# EAGLE design Schematic_start_module_sumo_IR_V0_16 (EAGLE 5.11)
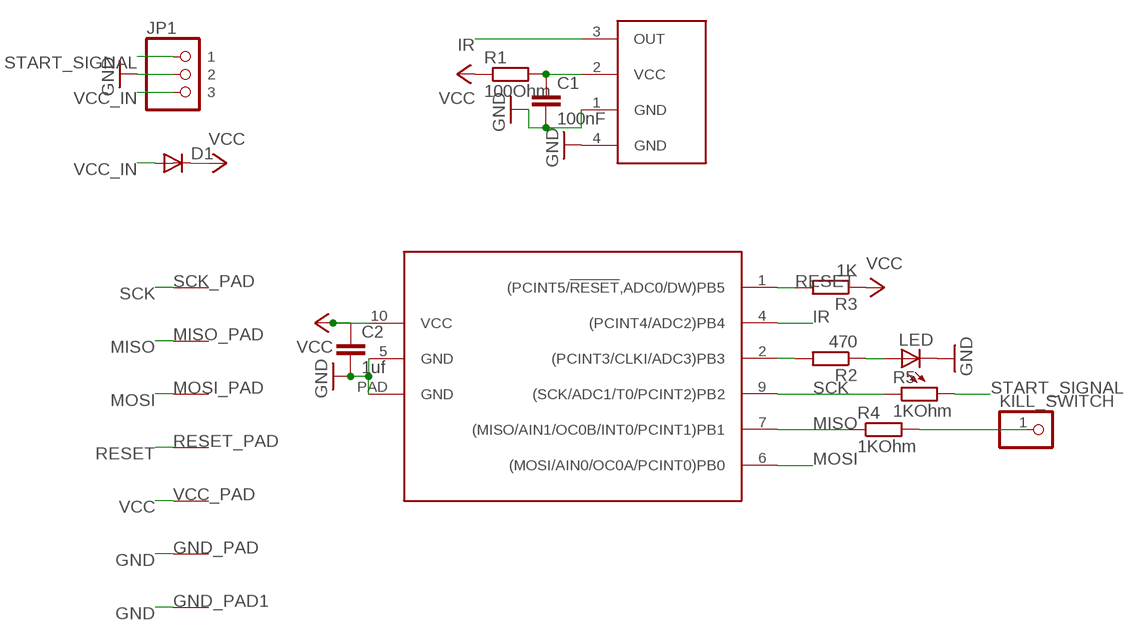
[diagram p0: schematic, sheet 1]

## Parts
C1  100nF  C-EUC0603  [C0603]
C2  1uf  C-EUC0603  [C0603]
D1  DIODE-SOD523  [SOD523]
GND_PAD  PAD50X50  [PAD_50X50]
GND_PAD1  PAD75X75  [PAD_75X75]
IR1  TSOP77338TS  [TSOP77338]
JP1  PINHD-1X3PIN  [1X3]
KILL_SWITCH  PINHD-1X1  [1X01]
LED  LED0603  [0603_SMALL]
MISO_PAD  PAD50X50  [PAD_50X50]
MOSI_PAD  mosi  PAD75X75  [PAD_75X75]
R1  100Ohm  R-EU_R0603  [R0603]
R2  470  R-EU_R0603  [R0603]
R3  1K  R-EU_R0603  [R0603]
R4  1KOhm  R-EU_R0603  [R0603]
R5  1KOhm  R-EU_R0603  [R0603]
RESET_PAD  PAD50X50  [PAD_50X50]
SCK_PAD  PAD50X50  [PAD_50X50]
UC  ATTINY13A  [DFN10]
VCC_PAD  PAD50X50  [PAD_50X50]

## Nets
GND: C1.2 C2.2 GND_PAD1.P$1(PAD) GND_PAD.P$1(PAD) IR1.1(GND) IR1.4(GND) JP1.2 LED.2(C) UC.5(GND) UC.PAD(GND)
IR: IR1.3(OUT) UC.4((PCINT4/ADC2)PB4)
KILL_SWITCH: KILL_SWITCH.1 R4.2
MISO: MISO_PAD.P$1(PAD) R4.1 UC.7((MISO/AIN1/OC0B/INT0/PCINT1)PB1)
MOSI: MOSI_PAD.P$1(PAD) UC.6((MOSI/AIN0/OC0A/PCINT0)PB0)
N$1: R2.2 UC.2((PCINT3/CLKI/ADC3)PB3)
N$3: LED.1(A) R2.1
N$6: C1.1 IR1.2(VCC) R1.2
RESET: R3.2 RESET_PAD.P$1(PAD) UC.1((PCINT5/!RESET,ADC0/DW)PB5)
SCK: R5.1 SCK_PAD.P$1(PAD) UC.9((SCK/ADC1/T0/PCINT2)PB2)
START_SIGNAL: JP1.1 R5.2
VCC: C2.1 D1.C R1.1 R3.1 UC.10(VCC) VCC_PAD.P$1(PAD)
VCC_IN: D1.A JP1.3

## Library data of the parts
C1 C2 = rcl:C-EU: CAPACITOR, European symbol
D1 = diode:DIODE-: DIODE
GND_PAD GND_PAD1 MISO_PAD MOSI_PAD RESET_PAD SCK_PAD VCC_PAD = CRF:PAD
IR1 = CRF:TSOP77338: Liten IR receiver ytmonterad ca 12kr på Farnell. http://www.vishay.com/docs/83346/tsop773.pdf
JP1 = CRF:PINHD-1X3: PIN HEADER
KILL_SWITCH = pinhead:PINHD-1X1: PIN HEADER
LED = CRF:LED: LED
R1-R5 = rcl:R-EU_: RESISTOR, European symbol
UC = CRF:ATTINY13A

## Board
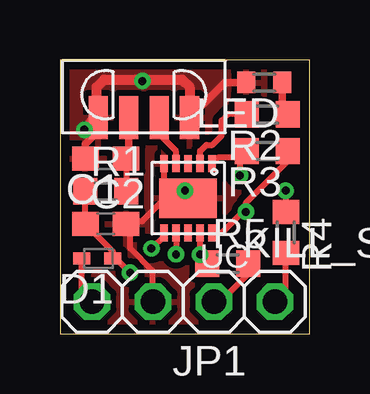
[diagram p1: board, top side]
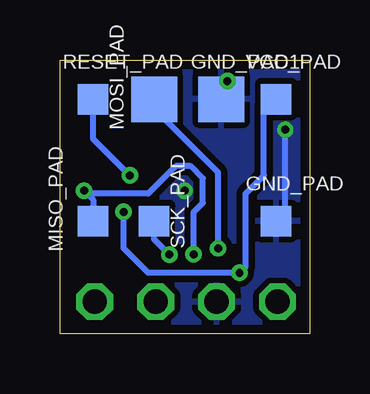
[diagram p2: board, bottom side, seen from below]

Size 10.4 x 11.42 mm. Coordinates in mm from the lower left corner, seen from the top.
Outline: 0,0 10.4,0 10.4,11.42 0,11.42 0,0
Copper layers (1*16): Top 0.0356mm / dielectric 1.5011mm / Bottom 0.0356mm
Design rules "LaenPCBOrder *": minimum track width 6mil, minimum drill 13mil, track to track 8mil, track to pad 8mil, pad to pad 8mil, via to via 8mil, smd to smd 0mil, copper to edge 15mil, drill to drill 6mil, minimum pad ring 7mil, minimum via ring 7mil, stop-mask expansion 4mil, vias tented up to drill 13mil, thermal gap 10mil

### Footprints (pad centres in the part's own frame; a part is rotated, then mirrored left to right if it is on the bottom)
C0603 = smd 1.1 x 1: 1 -0.85,0; 2 0.85,0
SOD523 = smd 0.7 x 0.5: A 0.7,0; C -0.6,0
PAD_50X50 = smd 1.27 x 1.27: P$1 0,0
PAD_75X75 = smd 1.905 x 1.905: P$1 0,0
TSOP77338 = smd 0.8 x 1.8: 1 -1.905,0.635; 2 -0.633,0.635; 3 0.637,0.635; 4 1.905,0.635
1X3 = drill 1.016 octagon: 1 -2.54,0; 2 0,0; 3 2.54,0
1X01 = drill 1.016 octagon: 1 0,0
0603_SMALL = smd 0.75 x 0.9: 1 -0.75,0; 2 0.75,0
R0603 = smd 1 x 1.1: 1 -0.85,0; 2 0.85,0
DFN10 = smd 0.3 x 0.7: 1 -1,-1.45; 2 -0.5,-1.45; 3 0,-1.45; 4 0.5,-1.45; 5 1,-1.45; 6 1,1.45; 7 0.5,1.45; 8 0,1.45; 9 -0.5,1.45; 10 -1,1.45 | smd 2.38 x 1.65: PAD 0,0

### Placement (x,y rotation side)
C1  1.91,7.3 180 top
C2  1.91,4.57 0 top
D1  1.6,3.14 180 top
GND_PAD  1.4,4.7 0 bottom
GND_PAD1  3.68,9.78 0 bottom
IR1  3.49,8.38 0 top
JP1  3.87,1.33 180 top
KILL_SWITCH  8.95,1.33 0 top
LED  8.51,10.48 180 top
MISO_PAD  9.02,4.7 90 bottom
MOSI_PAD  6.48,9.78 90 bottom
R1  1.91,5.94 0 top
R2  8.64,9.14 180 top
R3  8.64,7.62 180 top
R4  9.41,4.22 270 top
R5  6.99,2.92 0 top
RESET_PAD  9.02,9.78 0 bottom
SCK_PAD  6.48,4.7 180 bottom
UC  5.33,5.65 180 top
VCC_PAD  1.4,9.78 0 bottom

### Tracks (layer width: path | path; a pad name or v marks a point on that pad's centre or on a via)
GND  (via drill 0.33 pad 0.69)
  Top 0.254: 5.43,5.81 5.11,5.49 4.45,5.49 | 4.45,5.49 4.22,5.49 3.43,4.7 2.88,4.7 C2.2 2.92,4.41 2.92,3.56 3.87,2.6 JP1.2 | UC.5 4.33,5.6 4.45,5.49 | v3.43,10.54 3.37,10.6 3.17,10.6
  Top 0.305: 5.43,5.81 5.43,5.65 UC.PAD | 5.11,5.49 5.11,5.02 | 5.11,5.49 | C1.2 1.05,7.91 1.65,8.51 | 1.65,8.51 1.65,8.95 IR1.1 | IR1.4 6.86,10.48 LED.2 | 1.65,8.51 1.27,8.89 v1.02,8.51
  Top 0.406: IR1.1 1.52,9.08 1.52,10.29 1.84,10.6 3.17,10.6 5.08,10.6 5.4,10.29 IR1.4
  Bottom 0.254: GND_PAD1.P$1 3.68,10.41 v3.43,10.54 | GND_PAD.P$1 1.02,4.7 v1.02,8.51
  other vias: 5.21,5.97
  pour Top (isolate 0.254): -1.91,12.45 11.94,12.45 11.94,-1.91 -1.91,-1.91
  pour Bottom (isolate 0.254): -0.51,11.94 10.67,11.94 10.67,-0.89 -0.51,-0.89
IR
  Top 0.254: IR1.3 4.13,8.32 4.83,7.61 UC.4
KILL_SWITCH
  Top 0.254: KILL_SWITCH.1 9.41,1.79 R4.2
MISO  (via drill 0.33 pad 0.69)
  Top 0.254: UC.7 v4.83,3.31 v4.83,3.3 | v9.4,5.97 9.41,5.96 R4.1
  Bottom 0.254: v4.83,3.31 4.83,5.07 4.45,5.46 4.45,6.48 4.95,6.99 5.59,6.99 6.73,5.84 9.27,5.84 v9.4,5.97 9.02,5.59 MISO_PAD.P$1
MOSI  (via drill 0.33 pad 0.69)
  Top 0.254: UC.6 4.33,4.08 v3.81,3.56
  Bottom 0.254: v3.81,3.56 3.81,6.73 6.35,9.27 MOSI_PAD.P$1
N$1
  Top 0.254: R2.2 7.69,9.09 | R2.2 7.6,9.27 7.6,9.25 | UC.2 5.83,7.49 5.84,7.49 5.84,7.62 6.1,7.87 6.35,7.87 6.73,8.26 6.73,8.89 7.02,9.18 R2.2
N$3
  Top 0.254: R2.1 9.08,9.42
  Top 0.305: 9.08,9.42 9.26,9.6 LED.1
N$6
  Top 0.254: 2.44,7.33 2.57,7.46 | 2.57,7.46 2.86,7.75 2.86,7.43 | IR1.2 | 2.57,7.46 2.73,7.3 C1.1 R1.2
  Top 0.305: 2.86,7.75 IR1.2
RESET  (via drill 0.33 pad 0.69)
  Top 0.254: UC.1 6.6,7.37 7.47,7.37 R3.2 7.66,7.75 7.49,7.58 v7.49,6.6
  Bottom 0.254: v7.49,6.6 9.02,8.13 RESET_PAD.P$1
SCK  (via drill 0.33 pad 0.69)
  Top 0.254: UC.9 5.83,3.8 v5.84,3.3 | v5.84,3.3 5.97,3.43 | R5.1 6.13,3.01 v5.84,3.3
  Bottom 0.254: v5.84,3.3 6.48,3.94 SCK_PAD.P$1
START_SIGNAL
  Top 0.254: JP1.1 6.67,1.33 7.83,2.5 R5.2
VCC  (via drill 0.33 pad 0.69)
  Top 0.254: UC.10 6.61,4.2 | R3.1 9.4,7.59 | R1.1 C2.1 2.2,3.42 D1.C 2.33,3.13 v2.92,2.54 | UC.10 6.33,3.95 | UC.10 6.74,4.2 7.62,5.08 v7.75,5.08 7.75,5.46 9.49,7.2 R3.1 | R3.1 9.49,7.33
  Bottom 0.254: VCC_PAD.P$1 1.91,9.53 1.91,6.6 2.67,5.84 2.67,2.79 v2.92,2.54 6.73,2.54 7.75,3.56 v7.75,5.08
VCC_IN
  Top 0.254: D1.A 0.9,1.76 JP1.3

### Text on the board
tTest: V0.16
bTest: GND | HOME | VCC | GND | Start | Kill